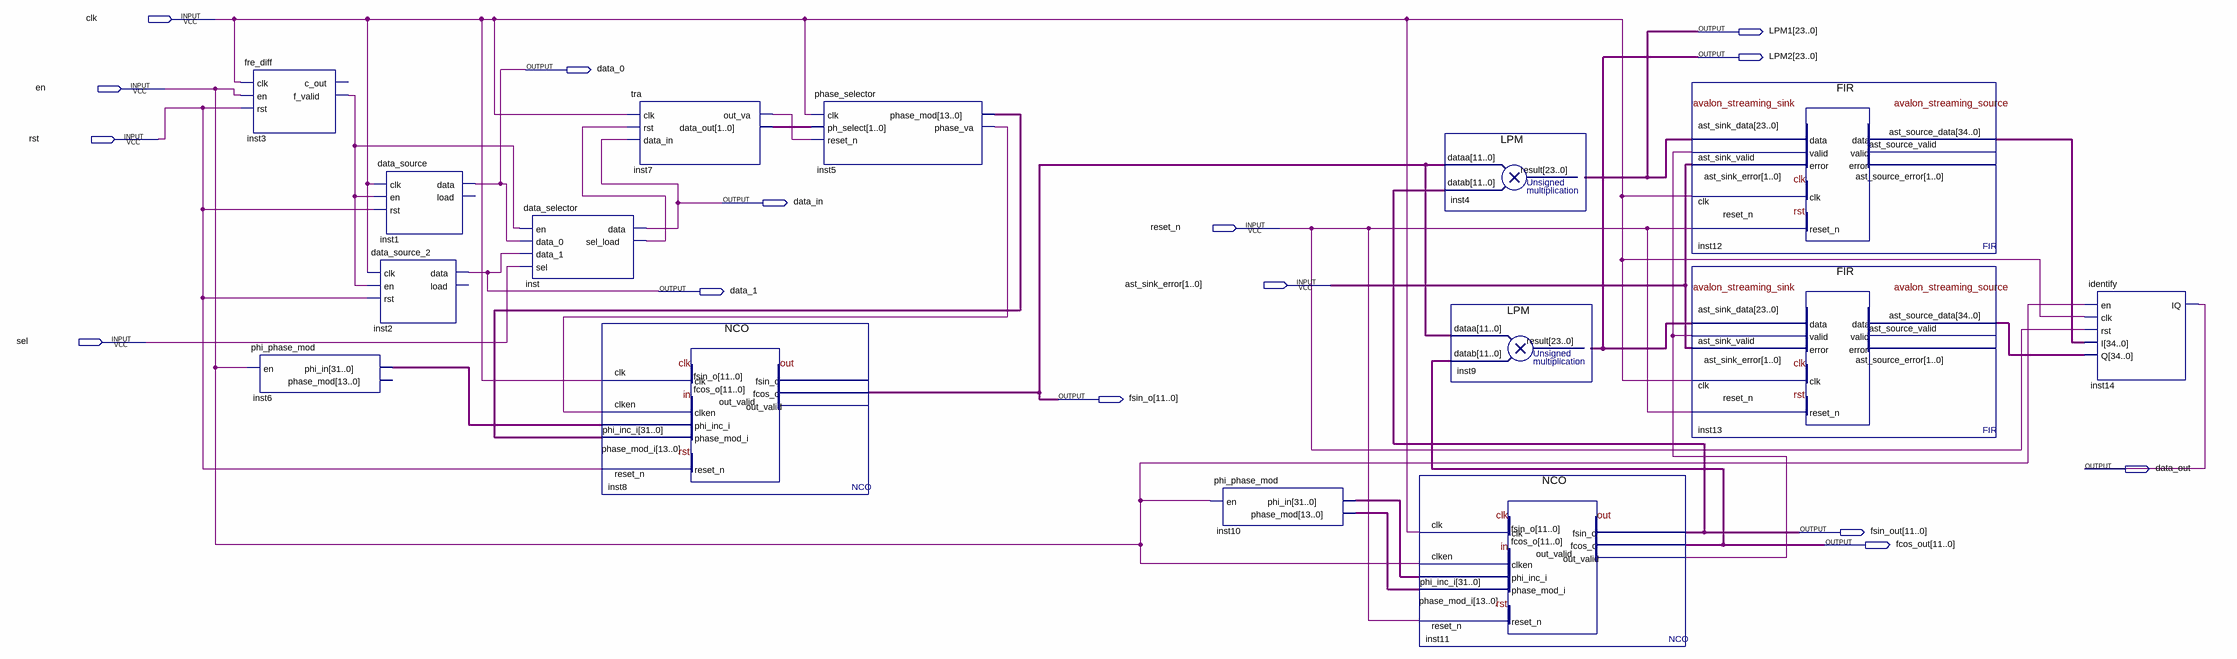
[diagram p0: schematic sheet]
// Quartus schematic QPSKcodedecode.bdf as structural Verilog: 15 symbols, 15 pins
module QPSKcodedecode (
  input  clk,
  input  en,
  input  rst,
  input  reset_n,
  input  [1:0] ast_sink_error,
  input  sel,
  output [23:0] LPM1,
  output [23:0] LPM2,
  output data_0,
  output data_in,
  output data_1,
  output [11:0] fsin_o,
  output data_out,
  output [11:0] fsin_out,
  output [11:0] fcos_out
);

  wire inst3_f_valid, inst5_phase_va, inst7_out_va, inst11_out_valid, inst_sel_load;
  wire [1:0] inst7_data_out;
  wire [13:0] inst5_phase_mod, inst10_phase_mod;
  wire [31:0] inst6_phi_in, inst10_phi_in;
  wire [34:0] inst12_ast_source_data, inst13_ast_source_data;

  fre_diff inst3 (.clk(clk), .en(en), .rst(rst), .f_valid(inst3_f_valid));  // open: c_out
  phi_phase_mod inst6 (.en(en), .phi_in(inst6_phi_in));  // open: phase_mod
  data_source inst1 (.clk(clk), .en(inst3_f_valid), .rst(rst), .data(data_0));  // open: load
  data_source_2 inst2 (.clk(clk), .en(inst3_f_valid), .rst(rst), .data(data_1));  // open: load
  data_selector inst (
    .en(inst3_f_valid), .data_0(data_0), .data_1(data_1), .sel(sel), .data(data_in), .sel_load(inst_sel_load));
  tra inst7 (.clk(clk), .rst(inst_sel_load), .data_in(data_in), .out_va(inst7_out_va), .data_out(inst7_data_out));
  NCO inst8 (
    .clk(clk), .clken(inst5_phase_va), .phi_inc_i(inst6_phi_in), .phase_mod_i(inst5_phase_mod),
    .reset_n(rst), .fcos_o(fsin_o));  // open: fsin_o, out_valid
  phase_selector inst5 (
    .clk(clk), .ph_select(inst7_data_out), .reset_n(inst7_out_va), .phase_mod(inst5_phase_mod),
    .phase_va(inst5_phase_va));
  phi_phase_mod inst10 (.en(en), .phi_in(inst10_phi_in), .phase_mod(inst10_phase_mod));
  LPM inst4 (.dataa(fsin_o), .datab(fsin_out), .result(LPM1));
  LPM inst9 (.dataa(fsin_o), .datab(fcos_out), .result(LPM2));
  NCO inst11 (
    .clk(clk), .clken(en), .phi_inc_i(inst10_phi_in), .phase_mod_i(inst10_phase_mod), .reset_n(reset_n),
    .fsin_o(fsin_out), .fcos_o(fcos_out), .out_valid(inst11_out_valid));
  FIR inst12 (
    .ast_sink_data(LPM1), .ast_sink_valid(inst11_out_valid), .ast_sink_error(ast_sink_error), .clk(clk),
    .reset_n(reset_n), .ast_source_data(inst12_ast_source_data));  // open: ast_source_valid, ast_source_error
  FIR inst13 (
    .ast_sink_data(LPM2), .ast_sink_valid(inst11_out_valid), .ast_sink_error(ast_sink_error), .clk(clk),
    .reset_n(reset_n), .ast_source_data(inst13_ast_source_data));  // open: ast_source_valid, ast_source_error
  identify inst14 (
    .en(en), .clk(clk), .rst(reset_n), .I(inst12_ast_source_data), .Q(inst13_ast_source_data), .IQ(data_out));
endmodule
